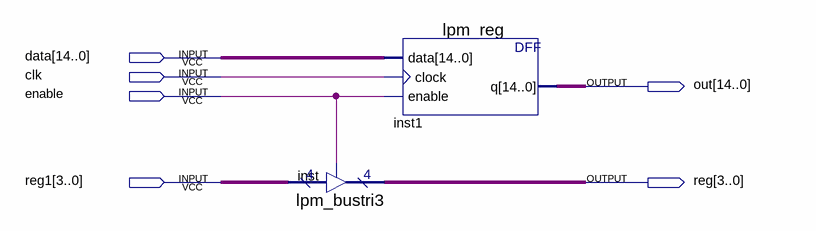
[diagram p0: schematic sheet]
// Quartus schematic loadOP1.bdf as structural Verilog: 2 symbols, 6 pins
module loadOP1 (
  input  [14:0] data,
  input  clk,
  input  enable,
  input  [3:0] reg1,
  output [14:0] out,
  output [3:0] \reg 
);

  lpm_bustri3 inst (.enabledt(enable), .data(reg1), .tridata(\reg ));
  lpm_reg inst1 (.data(data), .clock(clk), .enable(enable), .q(out));
endmodule
